# EAGLE design CoProcessorSP20 (EAGLE 9.6.2)

## Sheet 1 of 3: Connectors
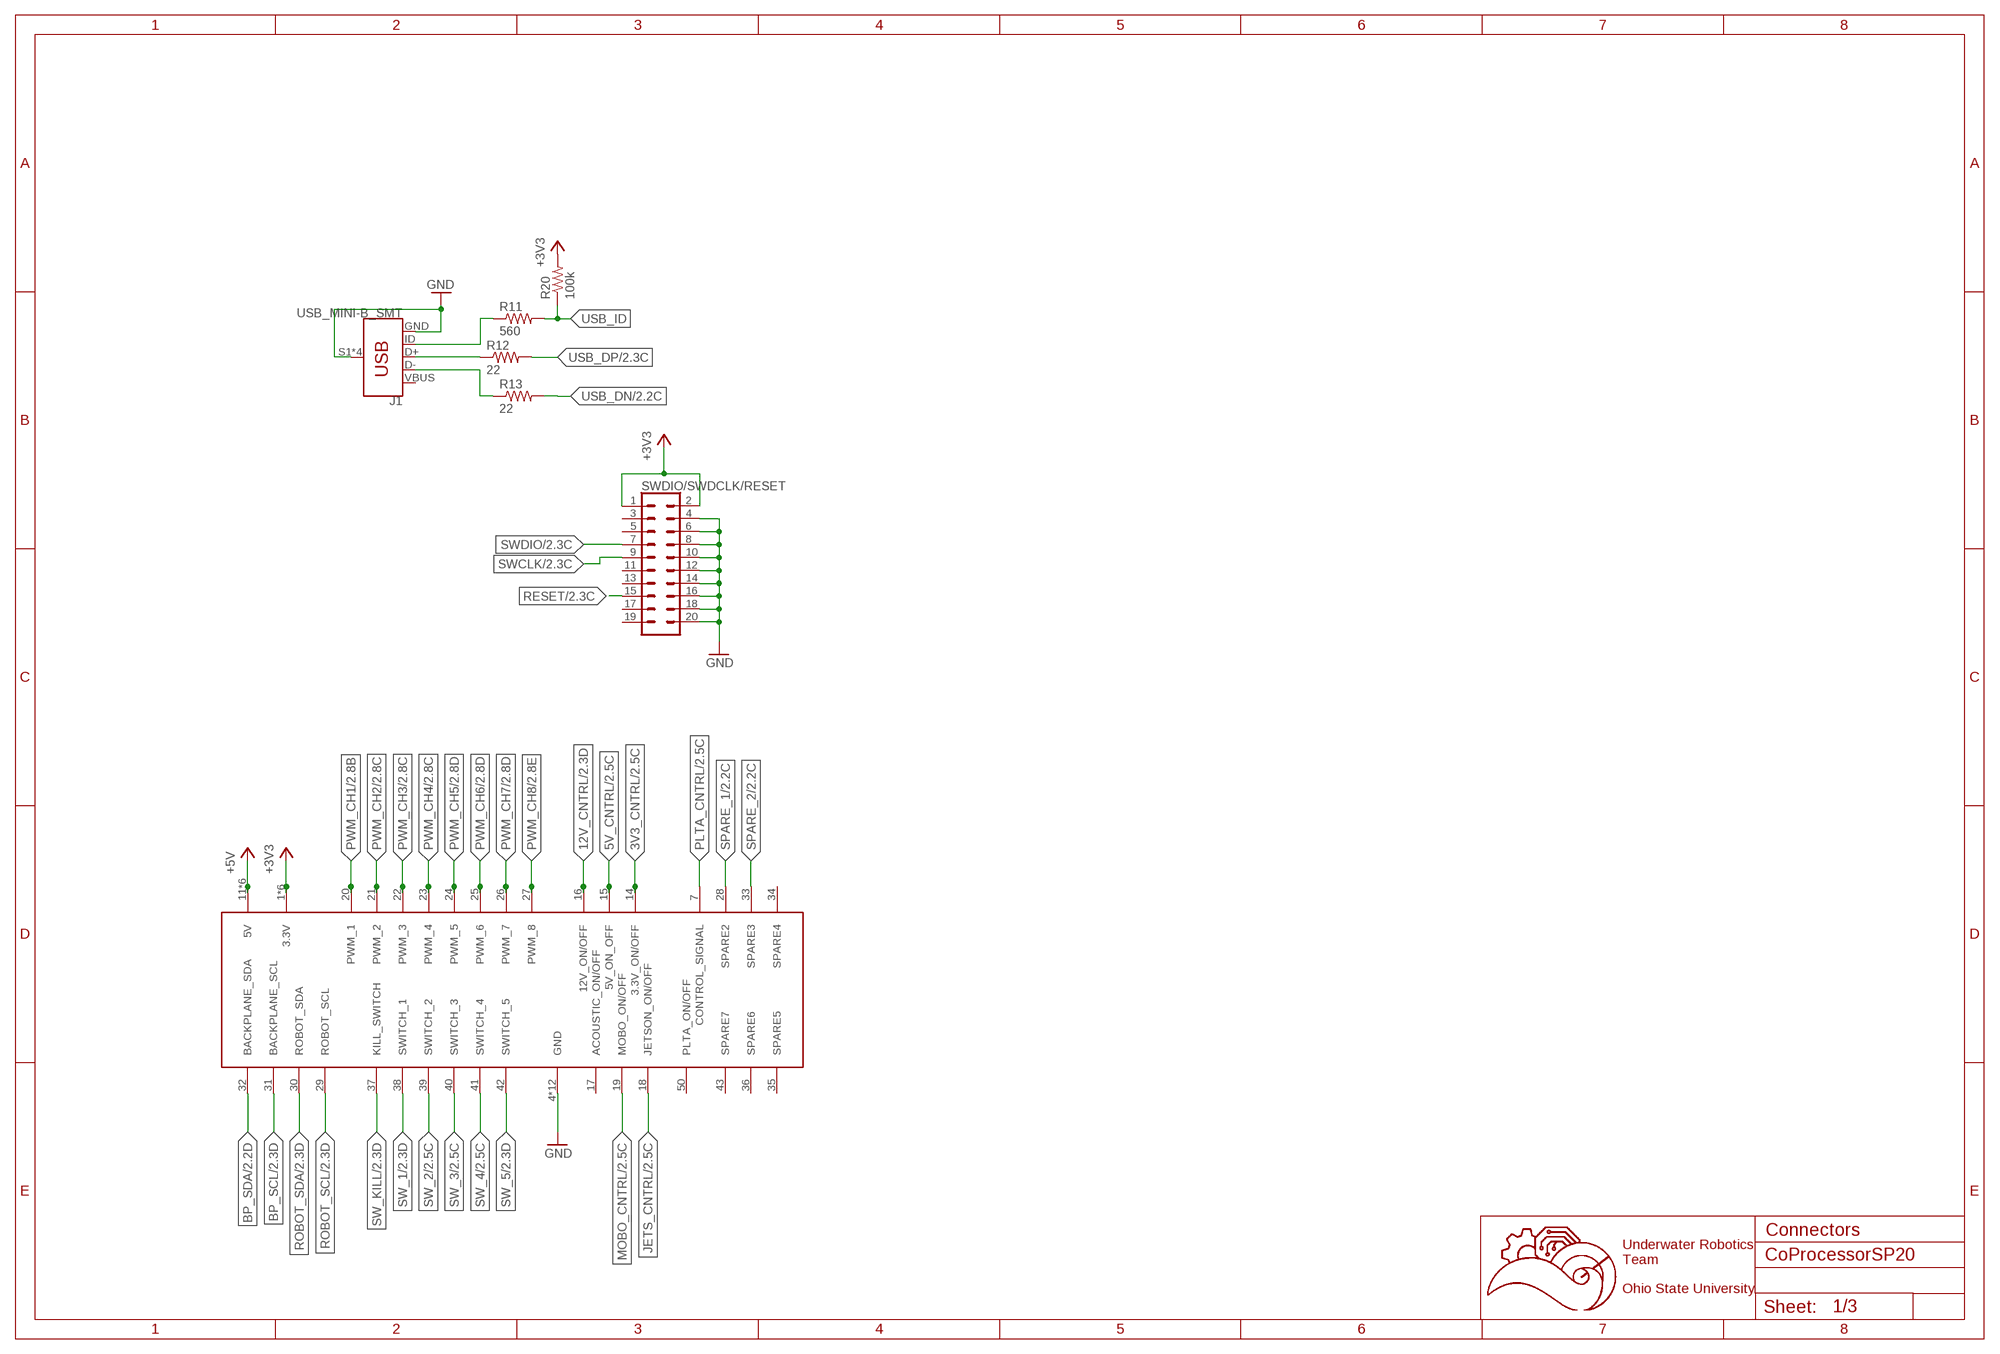
[diagram p0: schematic, sheet 1]

### Parts
J1  USB_MINI-B_SMT  [USB-MINIB]
R11  560  R-US_R0603  [R0603]
R12  22  R-US_R0603  [R0603]
R13  22  R-US_R0603  [R0603]
R20  100k  R-US_R0603  [R0603]
SWDIO/SWDCLK/RESET  CONN_10X2  [2X10]
U$1  5530843-EDGE  [5530843-6-BOARDFINGERS]

### Nets
3V3_CNTRL: U$1.14(3.3V_ON/OFF) ; also sheet 2
5V_CNTRL: U$1.15(5V_ON_OFF) ; also sheet 2
12V_CNTRL: U$1.16(12V_ON/OFF) ; also sheet 2
+3V3: R20.2 SWDIO/SWDCLK/RESET.1 SWDIO/SWDCLK/RESET.2 U$1.1(3.3V) U$1.2(3.3V) U$1.3(3.3V) U$1.54(3.3V) U$1.55(3.3V) U$1.56(3.3V) ; also sheet 2,3
+5V: U$1.11(5V) U$1.12(5V) U$1.13(5V) U$1.44(5V) U$1.45(5V) U$1.46(5V)
BP_SCL: U$1.31(BACKPLANE_SCL) ; also sheet 2
BP_SDA: U$1.32(BACKPLANE_SDA) ; also sheet 2
GND: J1.GND J1.S1(SHIELD) J1.S2(SHIELD) J1.S3(SHIELD) J1.S4(SHIELD) SWDIO/SWDCLK/RESET.4 SWDIO/SWDCLK/RESET.6 SWDIO/SWDCLK/RESET.8 SWDIO/SWDCLK/RESET.10 SWDIO/SWDCLK/RESET.12 SWDIO/SWDCLK/RESET.14 SWDIO/SWDCLK/RESET.16 SWDIO/SWDCLK/RESET.18 SWDIO/SWDCLK/RESET.20 U$1.4(GND) U$1.5(GND) U$1.6(GND) U$1.8(GND) U$1.9(GND) U$1.10(GND) U$1.47(GND) U$1.48(GND) U$1.49(GND) U$1.51(GND) U$1.52(GND) U$1.53(GND) ; also sheet 2,3
JETS_CNTRL: U$1.18(JETSON_ON/OFF) ; also sheet 2
MOBO_CNTRL: U$1.19(MOBO_ON/OFF) ; also sheet 2
N$2: J1.ID R11.1
N$4: J1.D+ R12.1
N$5: J1.D- R13.1
PLTA_CNTRL: U$1.7(CONTROL_SIGNAL) ; also sheet 2
PWM_CH1: U$1.20(PWM_1) ; also sheet 2
PWM_CH2: U$1.21(PWM_2) ; also sheet 2
PWM_CH3: U$1.22(PWM_3) ; also sheet 2
PWM_CH4: U$1.23(PWM_4) ; also sheet 2
PWM_CH5: U$1.24(PWM_5) ; also sheet 2
PWM_CH6: U$1.25(PWM_6) ; also sheet 2
PWM_CH7: U$1.26(PWM_7) ; also sheet 2
PWM_CH8: U$1.27(PWM_8) ; also sheet 2
RESET: SWDIO/SWDCLK/RESET.15 ; also sheet 2
ROBOT_SCL: U$1.29(ROBOT_SCL) ; also sheet 2
ROBOT_SDA: U$1.30(ROBOT_SDA) ; also sheet 2
SPARE_1: U$1.28(SPARE2) ; also sheet 2
SPARE_2: U$1.33(SPARE3) ; also sheet 2
SW_1: U$1.38(SWITCH_1) ; also sheet 2
SW_2: U$1.39(SWITCH_2) ; also sheet 2
SW_3: U$1.40(SWITCH_3) ; also sheet 2
SW_4: U$1.41(SWITCH_4) ; also sheet 2
SW_5: U$1.42(SWITCH_5) ; also sheet 2
SW_KILL: U$1.37(KILL_SWITCH) ; also sheet 2
SWCLK: SWDIO/SWDCLK/RESET.9 ; also sheet 2
SWDIO: SWDIO/SWDCLK/RESET.7 ; also sheet 2
USB_DN: R13.2 ; also sheet 2
USB_DP: R12.2 ; also sheet 2
USB_ID: R11.2 R20.1
Unconnected: SWDIO/SWDCLK/RESET.3 SWDIO/SWDCLK/RESET.5 SWDIO/SWDCLK/RESET.11 SWDIO/SWDCLK/RESET.13 SWDIO/SWDCLK/RESET.17 SWDIO/SWDCLK/RESET.19 U$1.17(ACOUSTIC_ON/OFF) U$1.34(SPARE4) U$1.35(SPARE5) U$1.36(SPARE6) U$1.43(SPARE7) U$1.50(PLTA_ON/OFF)

### Notes on the sheet
- Connectors
- Underwater Robotics
  Team
  
  Ohio State University

## Sheet 2 of 3: MCU
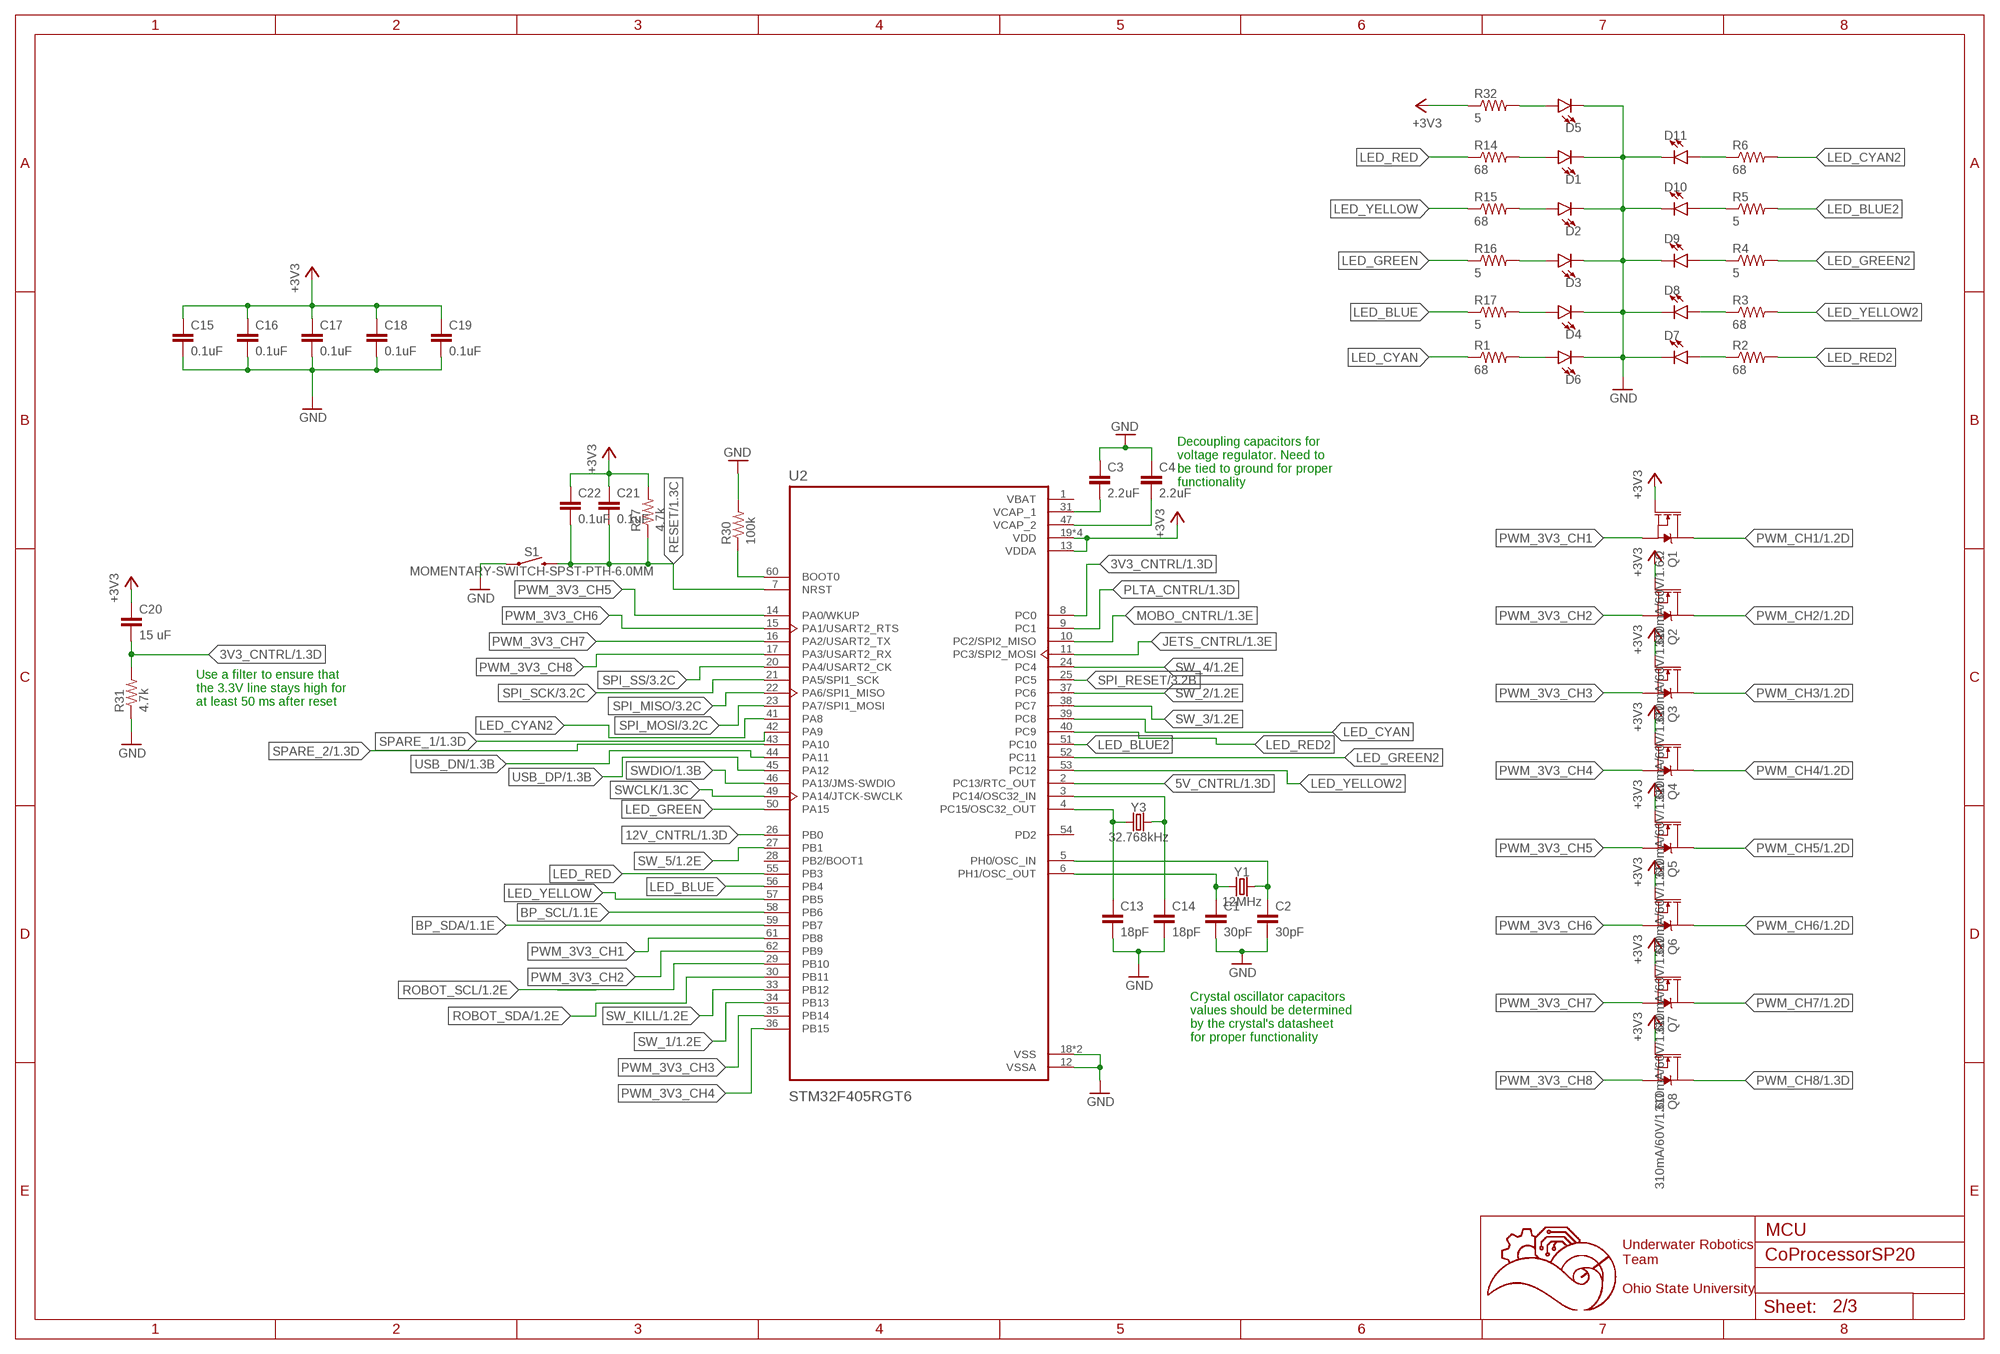
[diagram p1: schematic, sheet 2]

### Parts
C1  30pF  C-EUC0603  [C0603]
C2  30pF  C-EUC0603  [C0603]
C3  2.2uF  C-EUC0603  [C0603]
C4  2.2uF  C-EUC0603  [C0603]
C13  18pF  C-EUC0603  [C0603]
C14  18pF  C-EUC0603  [C0603]
C15  0.1uF  C-EUC0603  [C0603]
C16  0.1uF  C-EUC0603  [C0603]
C17  0.1uF  C-EUC0603  [C0603]
C18  0.1uF  C-EUC0603  [C0603]
C19  0.1uF  C-EUC0603  [C0603]
C20  15 uF  C-EU050-025X075  [C050-025X075]
C21  0.1uF  C-EUC0603  [C0603]
C22  0.1uF  C-EUC0603  [C0603]
D1  LED0603  [LED-0603]
D2  LED0603  [LED-0603]
D3  LED0603  [LED-0603]
D4  LED0603  [LED-0603]
D5  LED0603  [LED-0603]
D6  LED0603  [LED-0603]
D7  LED0603  [LED-0603]
D8  LED0603  [LED-0603]
D9  LED0603  [LED-0603]
D10  LED0603  [LED-0603]
D11  LED0603  [LED-0603]
Q1  310mA/60V/1.6Ω  MOSFET-NCH-2N7002PW  [SOT323]
Q2  310mA/60V/1.6Ω  MOSFET-NCH-2N7002PW  [SOT323]
Q3  310mA/60V/1.6Ω  MOSFET-NCH-2N7002PW  [SOT323]
Q4  310mA/60V/1.6Ω  MOSFET-NCH-2N7002PW  [SOT323]
Q5  310mA/60V/1.6Ω  MOSFET-NCH-2N7002PW  [SOT323]
Q6  310mA/60V/1.6Ω  MOSFET-NCH-2N7002PW  [SOT323]
Q7  310mA/60V/1.6Ω  MOSFET-NCH-2N7002PW  [SOT323]
Q8  310mA/60V/1.6Ω  MOSFET-NCH-2N7002PW  [SOT323]
R1  68  R-US_R0603  [R0603]
R2  68  R-US_R0603  [R0603]
R3  68  R-US_R0603  [R0603]
R4  5  R-US_R0603  [R0603]
R5  5  R-US_R0603  [R0603]
R6  68  R-US_R0603  [R0603]
R14  68  R-US_R0603  [R0603]
R15  68  R-US_R0603  [R0603]
R16  5  R-US_R0603  [R0603]
R17  5  R-US_R0603  [R0603]
R27  4.7k  R-US_R0603  [R0603]
R30  100k  R-US_R0603  [R0603]
R31  4.7k  R-US_R0603  [R0603]
R32  5  R-US_R0603  [R0603]
S1  MOMENTARY-SWITCH-SPST-PTH-6.0MM  [TACTILE_SWITCH_PTH_6.0MM]
U2  STM32F405RGT6  [QFP50P1200X1200X160-64N]
Y1  12MHz  CRYSTAL-16MHZPTH-HC49US  [HC49US]
Y3  32.768kHz  CRYSTAL-32.768KHZSMD-3.2X1.5  [CRYSTAL-SMD-3.2X1.5MM]

### Nets
3V3_CNTRL: C20.2 R31.2 U2.8(PC0) ; also sheet 1
5V_CNTRL: U2.2(PC13/RTC_OUT) ; also sheet 1
12V_CNTRL: U2.26(PB0) ; also sheet 1
+3V3: C15.1 C16.1 C17.1 C18.1 C19.1 C20.1 C21.1 C22.1 Q1.1(G) Q2.1(G) Q3.1(G) Q4.1(G) Q5.1(G) Q6.1(G) Q7.1(G) Q8.1(G) R27.2 R32.1 U2.13(VDDA) U2.19(VDD) U2.32(VDD) U2.48(VDD) U2.64(VDD) ; also sheet 1,3
BP_SCL: U2.58(PB6) ; also sheet 1
BP_SDA: U2.59(PB7) ; also sheet 1
GND: C1.2 C2.2 C3.1 C4.1 C13.2 C14.2 C15.2 C16.2 C17.2 C18.2 C19.2 D1.C D2.C D3.C D4.C D5.C D6.C D7.C D8.C D9.C D10.C D11.C R30.2 R31.1 S1.1 U2.12(VSSA) U2.18(VSS) U2.63(VSS) ; also sheet 1,3
JETS_CNTRL: U2.11(PC3/SPI2_MOSI) ; also sheet 1
LED_BLUE: R17.1 U2.56(PB4)
LED_BLUE2: R5.2 U2.51(PC10)
LED_CYAN: R1.1 U2.39(PC8)
LED_CYAN2: R6.2 U2.41(PA8)
LED_GREEN: R16.1 U2.50(PA15)
LED_GREEN2: R4.2 U2.52(PC11)
LED_RED: R14.1 U2.55(PB3)
LED_RED2: R2.2 U2.40(PC9)
LED_YELLOW: R15.1 U2.57(PB5)
LED_YELLOW2: R3.2 U2.53(PC12)
MOBO_CNTRL: U2.10(PC2/SPI2_MISO) ; also sheet 1
N$1: C1.1 U2.6(PH1/OSC_OUT) Y1.1
N$3: D1.A R14.2
N$6: D2.A R15.2
N$7: D3.A R16.2
N$8: D4.A R17.2
N$9: C2.1 U2.5(PH0/OSC_IN) Y1.2
N$10: C4.2 U2.47(VCAP_2)
N$11: C3.2 U2.31(VCAP_1)
N$15: C13.1 U2.4(PC15/OSC32_OUT) Y3.P$1
N$29: C14.1 U2.3(PC14/OSC32_IN) Y3.P$2
N$30: R30.1 U2.60(BOOT0)
N$31: D5.A R32.2
N$32: D6.A R1.2
N$33: D7.A R2.1
N$35: D8.A R3.1
N$36: D9.A R4.1
N$37: D10.A R5.1
N$38: D11.A R6.1
PLTA_CNTRL: U2.9(PC1) ; also sheet 1
PWM_3V3_CH1: Q1.2(S) U2.61(PB8)
PWM_3V3_CH2: Q2.2(S) U2.62(PB9)
PWM_3V3_CH3: Q3.2(S) U2.35(PB14)
PWM_3V3_CH4: Q4.2(S) U2.36(PB15)
PWM_3V3_CH5: Q5.2(S) U2.14(PA0/WKUP)
PWM_3V3_CH6: Q6.2(S) U2.15(PA1/USART2_RTS)
PWM_3V3_CH7: Q7.2(S) U2.16(PA2/USART2_TX)
PWM_3V3_CH8: Q8.2(S) U2.17(PA3/USART2_RX)
PWM_CH1: Q1.3(D) ; also sheet 1
PWM_CH2: Q2.3(D) ; also sheet 1
PWM_CH3: Q3.3(D) ; also sheet 1
PWM_CH4: Q4.3(D) ; also sheet 1
PWM_CH5: Q5.3(D) ; also sheet 1
PWM_CH6: Q6.3(D) ; also sheet 1
PWM_CH7: Q7.3(D) ; also sheet 1
PWM_CH8: Q8.3(D) ; also sheet 1
RESET: C21.2 C22.2 R27.1 S1.3 U2.7(NRST) ; also sheet 1
ROBOT_SCL: U2.29(PB10) ; also sheet 1
ROBOT_SDA: U2.30(PB11) ; also sheet 1
SPARE_1: U2.42(PA9) ; also sheet 1
SPARE_2: U2.43(PA10) ; also sheet 1
SPI_MISO: U2.22(PA6/SPI1_MISO) ; also sheet 3
SPI_MOSI: U2.23(PA7/SPI1_MOSI) ; also sheet 3
SPI_RESET: U2.25(PC5) ; also sheet 3
SPI_SCK: U2.21(PA5/SPI1_SCK) ; also sheet 3
SPI_SS: U2.20(PA4/USART2_CK) ; also sheet 3
SW_1: U2.34(PB13) ; also sheet 1
SW_2: U2.37(PC6) ; also sheet 1
SW_3: U2.38(PC7) ; also sheet 1
SW_4: U2.24(PC4) ; also sheet 1
SW_5: U2.27(PB1) ; also sheet 1
SW_KILL: U2.33(PB12) ; also sheet 1
SWCLK: U2.49(PA14/JTCK-SWCLK) ; also sheet 1
SWDIO: U2.46(PA13/JMS-SWDIO) ; also sheet 1
USB_DN: U2.44(PA11) ; also sheet 1
USB_DP: U2.45(PA12) ; also sheet 1
Unconnected: U2.28(PB2/BOOT1) U2.54(PD2)

### Notes on the sheet
- Decoupling capacitors for 
  voltage regulator. Need to
  be tied to ground for proper
  functionality
- Use a filter to ensure that
  the 3.3V line stays high for
  at least 50 ms after reset
- Crystal oscillator capacitors
  values should be determined
  by the crystal's datasheet
  for proper functionality
- MCU
- Underwater Robotics
  Team
  
  Ohio State University

## Sheet 3 of 3: Ethernet
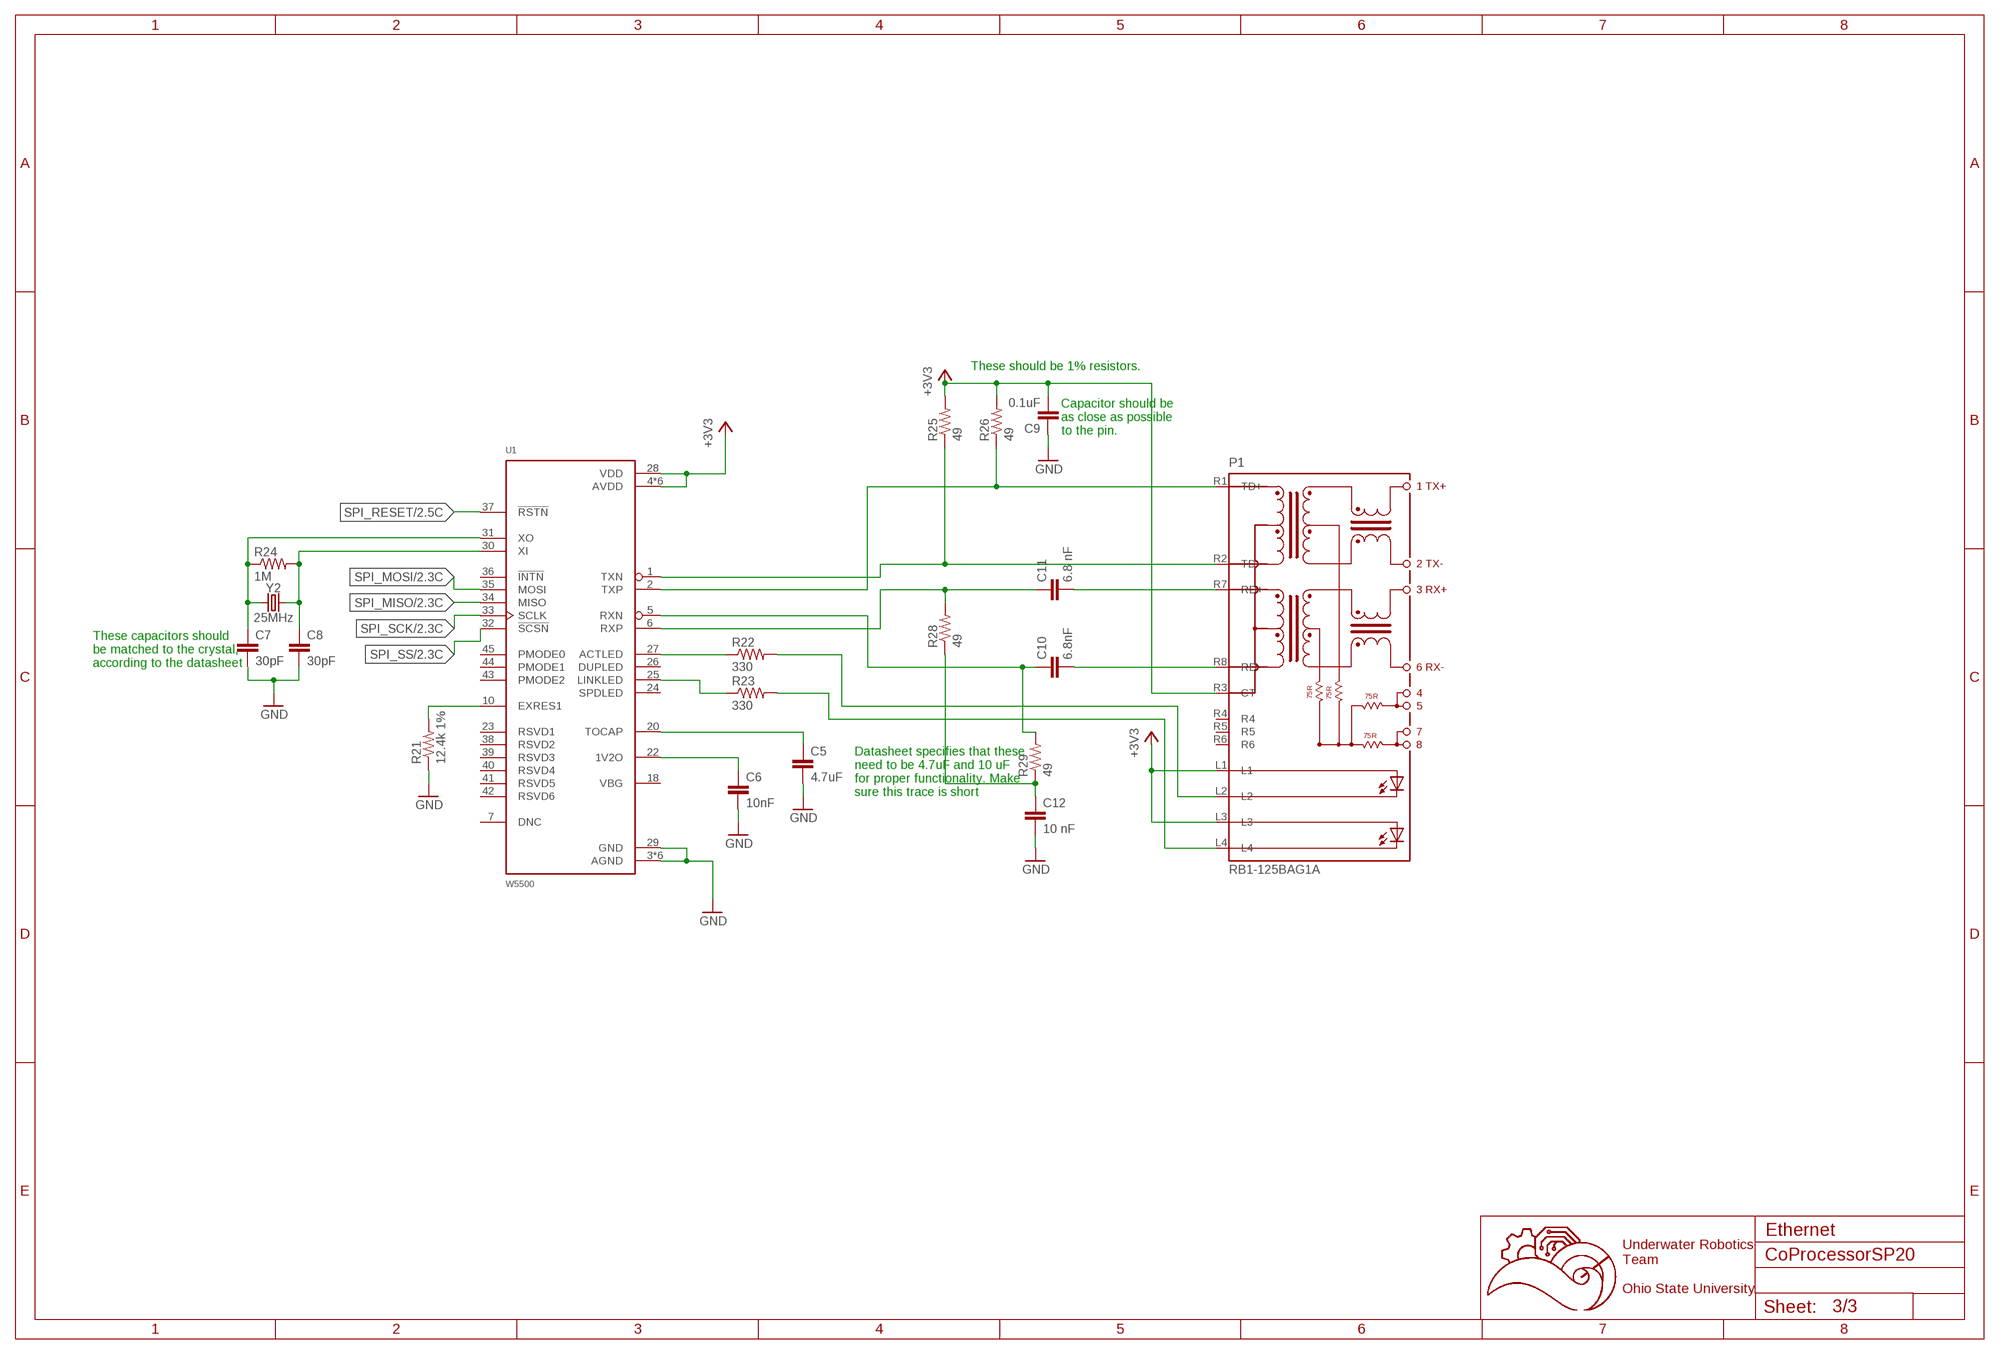
[diagram p2: schematic, sheet 3]

### Parts
C5  4.7uF  C-EUC0603  [C0603]
C6  10nF  C-EUC0603  [C0603]
C7  30pF  C-EUC0603  [C0603]
C8  30pF  C-EUC0603  [C0603]
C9  0.1uF  C-EUC0603  [C0603]
C10  6.8nF  C-EUC0603  [C0603]
C11  6.8 nF  C-EUC0603  [C0603]
C12  10 nF  C-EUC0603  [C0603]
P1  RB1-125BAG1A  [WIZNET_RB1-125BAG1A]
R21  12.4k 1%  R-US_R0603  [R0603]
R22  330  R-US_R0603  [R0603]
R23  330  R-US_R0603  [R0603]
R24  1M  R-US_R0603  [R0603]
R25  49  R-US_R0603  [R0603]
R26  49  R-US_R0603  [R0603]
R28  49  R-US_R0603  [R0603]
R29  49  R-US_R0603  [R0603]
U1  W5500  [QFP50P900X900X160-48N]
Y2  25MHz  CRYSTALPTH-HC49US  [HC49US]

### Nets
+3V3: C9.2 P1.L1 P1.L3 P1.R3(CT) R25.2 R26.2 U1.4(AVDD) U1.8(AVDD) U1.11(AVDD) U1.15(AVDD) U1.17(AVDD) U1.21(AVDD) U1.28(VDD) ; also sheet 1,2
GND: C5.2 C6.2 C7.2 C8.2 C9.1 C12.2 R21.1 U1.3(AGND) U1.9(AGND) U1.14(AGND) U1.16(AGND) U1.19(AGND) U1.29(GND) U1.48(AGND) ; also sheet 1,2
N$12: C5.1 U1.20(TOCAP)
N$13: C6.1 U1.22(1V2O)
N$14: R21.2 U1.10(EXRES1)
N$16: P1.R2(TD-) R25.1 U1.1(TXN)
N$17: P1.R1(TD+) R26.1 U1.2(TXP)
N$18: C10.1 R29.2 U1.5(RXN)
N$19: C11.1 R28.2 U1.6(RXP)
N$20: P1.L2 R22.2
N$21: P1.L4 R23.2
N$22: R22.1 U1.27(ACTLED)
N$23: R23.1 U1.25(LINKLED)
N$24: C8.1 R24.2 U1.30(XI) Y2.2
N$25: C7.1 R24.1 U1.31(XO) Y2.1
N$26: C10.2 P1.R8(RD-)
N$27: C11.2 P1.R7(RD+)
N$28: C12.1 R28.1 R29.1
SPI_MISO: U1.34(MISO) ; also sheet 2
SPI_MOSI: U1.35(MOSI) ; also sheet 2
SPI_RESET: U1.37(!RSTN) ; also sheet 2
SPI_SCK: U1.33(SCLK) ; also sheet 2
SPI_SS: U1.32(!SCSN) ; also sheet 2
Unconnected: P1.R4 P1.R5 P1.R6 U1.7(DNC) U1.18(VBG) U1.23(RSVD1) U1.24(SPDLED) U1.26(DUPLED) U1.36(!INTN) U1.38(RSVD2) U1.39(RSVD3) U1.40(RSVD4) U1.41(RSVD5) U1.42(RSVD6) U1.43(PMODE2) U1.44(PMODE1) U1.45(PMODE0)

### Notes on the sheet
- These should be 1% resistors.
- Capacitor should be
  as close as possible
  to the pin.
- These capacitors should
  be matched to the crystal,
  according to the datasheet
- Datasheet specifies that these
  need to be 4.7uF and 10 uF
  for proper functionality. Make 
  sure this trace is short
- Ethernet
- Underwater Robotics
  Team
  
  Ohio State University

## Power pins joined to a net without a drawn wire
VBAT: U2.1(VBAT)
VBUS: J1.VBUS

## Library data of the parts
C1-C22 = rcl:C-EU: CAPACITOR, European symbol; SPICEPREFIX: C
D1-D11 = SparkFun-LED:LED: LED (Generic) Standard schematic elements and footprints for 5mm, 3mm, 1206, and 0603 sized LEDs. Generic LEDs with no color specified.
J1 = SparkFun-Connectors:USB_MINI-B: USB type Mini-B Connector Breaks out 5th pin, and includes shield pins if needed. SparkFun Products: SparkFun FTDI Basic Breakout <https://www.sparkfun.com/products/9716> SparkFun XBee Explorer USB <https://www.sparkfun.com/products/11812> SparkFun Redboard <https://www.sparkfun.com/products/12757>; PROD_ID: CONN-08193; SF_ID: PRT-00587
P1 = RJ45-MAGJACK:RB1-125BAG1A: Accessory RJ-45 With Transformer Connector - UDE; AVAILABILITY: Unavailable; DESCRIPTION: Accessory RJ-45 With Transformer Connector - UDE; MF: WIZnet; MP: RB1-125BAG1A; PACKAGE: HVQFN-36 NXP Semiconductors; PRICE: None
Q1-Q8 = SparkFun-DiscreteSemi:MOSFET-NCH: N-channel MOSFETs Voltage controlled devices that allow control of high current outputs. SparkFun Products: SparkFun OpenScale <https://www.sparkfun.com/products/13261> SparkFun Digital Sandbox <https://www.sparkfun.com/products/12651> SparkFun Monster Moto Shield <https://www.sparkfun.com/products/10182> SparkFun MOSFET Power Controller <https://www.sparkfun.com/products/11214>; PROD_ID: TRANS-11151
R1-R6 R11-R17 R20-R32 = rcl:R-US_: RESISTOR, American symbol; SPICEPREFIX: R
S1 = SparkFun-Switches:MOMENTARY-SWITCH-SPST: Momentary Switch (Pushbutton) - SPST Normally-open (NO) SPST momentary switches (buttons, pushbuttons). Variants PTH-12MM - 12mm square, through-hole Momentary Pushbutton Switch - 12mm Square <https://www.sparkfun.com/products/9190> (COM-09190) PTH-6.0MM, PTH-6.0MM-KIT - 6.0mm square, through-hole Mini Pushbutton Switch <https://www.sparkfun.com/products/97> (COM-00097) KIT package intended for soldering kit's - only one side of pads' copper is exposed. PTH-RIGHT-ANGLE-KIT - Right-angle, through-hole Right Angle Tactile Button <https://www.sparkfun.com/products/10791> - Used on SparkFun BigTime Watch Kit <https://www.sparkfun.com/products/11734> SMD-12MM - 12mm square, surface-mount Tactile Button - SMD (12mm) <https://www.sparkfun.com/products/12993> (COM-12993) Used on SparkFun PicoBoard <https://www.sparkfun.com/products/11888> SMD-4.5MM - 4.5mm Square Trackball Switch Used on SparkFun Blackberry Trackballer Breakout <https://www.sparkfun.com/products/13169> SMD-4.6MMX2.8MM - 4.60mm x 2.80mm, surface mount Used on SparkFun SAMD21 Mini Breakout <https://www.sparkfun.com/products/13664> SMD-5.2MM, SMD-5.2-REDUNDANT - 5.2mm square, surface-mount Mini Pushbutton Switch - SMD <https://www.sparkfun.com/products/8720> (COM-08720) Used on Arduino Pro Mini <https://www.sparkfun.com/products/11114> REDUNDANT package connects both switch circuits together SMD-6.0X3.5MM - 6.0 x 3.5mm, surface mount Momentary Reset Switch SMD <https://www.sparkfun.com/products/8229> (COM-08229) SMD-6.2MM-TALL - 6.2mm square, surface mount Tactile Button - SMD (6mm) <https://www.sparkfun.com/products/12992> Used on SparkFun Digital Sandbox <https://www.sparkfun.com/products/12651> SMD-RIGHT-ANGLE - Right-angle, surface mount Used on SparkFun Block for Intel® Edison - Arduino <https://www.sparkfun.com/products/13036>; PROD_ID: SWCH-08441; SF_SKU: COM-00097
SWDIO/SWDCLK/RESET = SparkFun-Connectors:CONN_10X2: Multi connection point. Often used as Generic Header-pin footprint for 0.1 inch spaced/style header connections On any of the 0.1 inch spaced packages, you can populate with these: Break Away Headers - Straight <https://www.sparkfun.com/products/116> (PRT-00116) Break Away Male Headers - Right Angle <https://www.sparkfun.com/products/553> (PRT-00553) Female Headers <https://www.sparkfun.com/products/115> (PRT-00115) Break Away Headers - Machine Pin <https://www.sparkfun.com/products/117> (PRT-00117) Break Away Female Headers - Swiss Machine Pin <https://www.sparkfun.com/products/743> (PRT-00743) Special note about the "SPECIAL" package: This was SPECIALLY designed to be used with our Graphic LCD Backpack. Be sure you want to use this! It is not only staggered on each line of header holes, but IT IS ALSO offset of the center point of the top and bottom lines by 5 mil. This causes the headers to lock into place on the "standard" footprint on the LCD screen. The extra squares on the tdocu layer are there simply to reference other pins (if you were to actually populate a longer header than ten long - this is what we do with the backpacks).
U1 = W5500:W5500: Hardwired TCP/IP embedded Ethernet controller; AVAILABILITY: Unavailable; DESCRIPTION: Victor Pure White Collection Wood Tidy Tower Organizer; MF: WIZnet; MP: W5500; PACKAGE: LQFP-48 Victor Technologies; PRICE: None
U2 = STM32F405RGT6:STM32F405RGT6: High-performance foundation line, ARM Cortex-M4 core with DSP and FPU, 1 Mbyte Flash, 168 MHz CPU, ART Accelerator; AVAILABILITY: Unavailable; DESCRIPTION: High-performance foundation line, ARM Cortex-M4 core with DSP and FPU, 1 Mbyte Flash, 168 MHz CPU, ART Accelerator; MF: STMicroelectronics; MP: STM32F405RGT6; PACKAGE: LQFP-64 STMicroelectronics; PRICE: None
U$1 = 5530843-6:5530843-EDGE
Y1 = SparkFun-Clocks:CRYSTAL-16MHZ: 16MHz Crystal Digikey Example <http://www.digikey.com/product-search/en?keywords=535-9122-1-ND> Frequency: 16MHz Frequency Stability: ±50ppm Frequency Tolerance: ±20ppm Load Capacitance: 18pF SparkFun Products: Pro Micro -5V/16MHz <https://www.sparkfun.com/products/12640> SparkFun Serial Enabled LCD Kit <https://www.sparkfun.com/products/10097>; PROD_ID: XTAL-08181; SF_ID: COM-00536; VALUE: 16MHz
Y2 = SparkFun-Clocks:CRYSTAL: Crystals (Generic) These are passive quartz crystals, which can be used as a clock source for a microcontroller. Crystal's are two-terminal devices. They require external "load" capacitors to generate an oscillating signal.
Y3 = SparkFun-Clocks:CRYSTAL-32.768KHZ: 32.768kHz Crystal Frequency: 32.768kHz Frequency Stability: ±20ppm Load Capacitance: 12.5pF (PTH-2X6 & SMD-3.2X1.5), 6pF (SMD-2X6) SparkFun Products: SparkFun BigTime Watch Kit <https://www.sparkfun.com/products/11734> SparkFun nRF52832 Breakout <https://www.sparkfun.com/products/13990> SparkFun Real Time Clock Module <https://www.sparkfun.com/products/12708>; PROD_ID: XTAL-13062

## Board
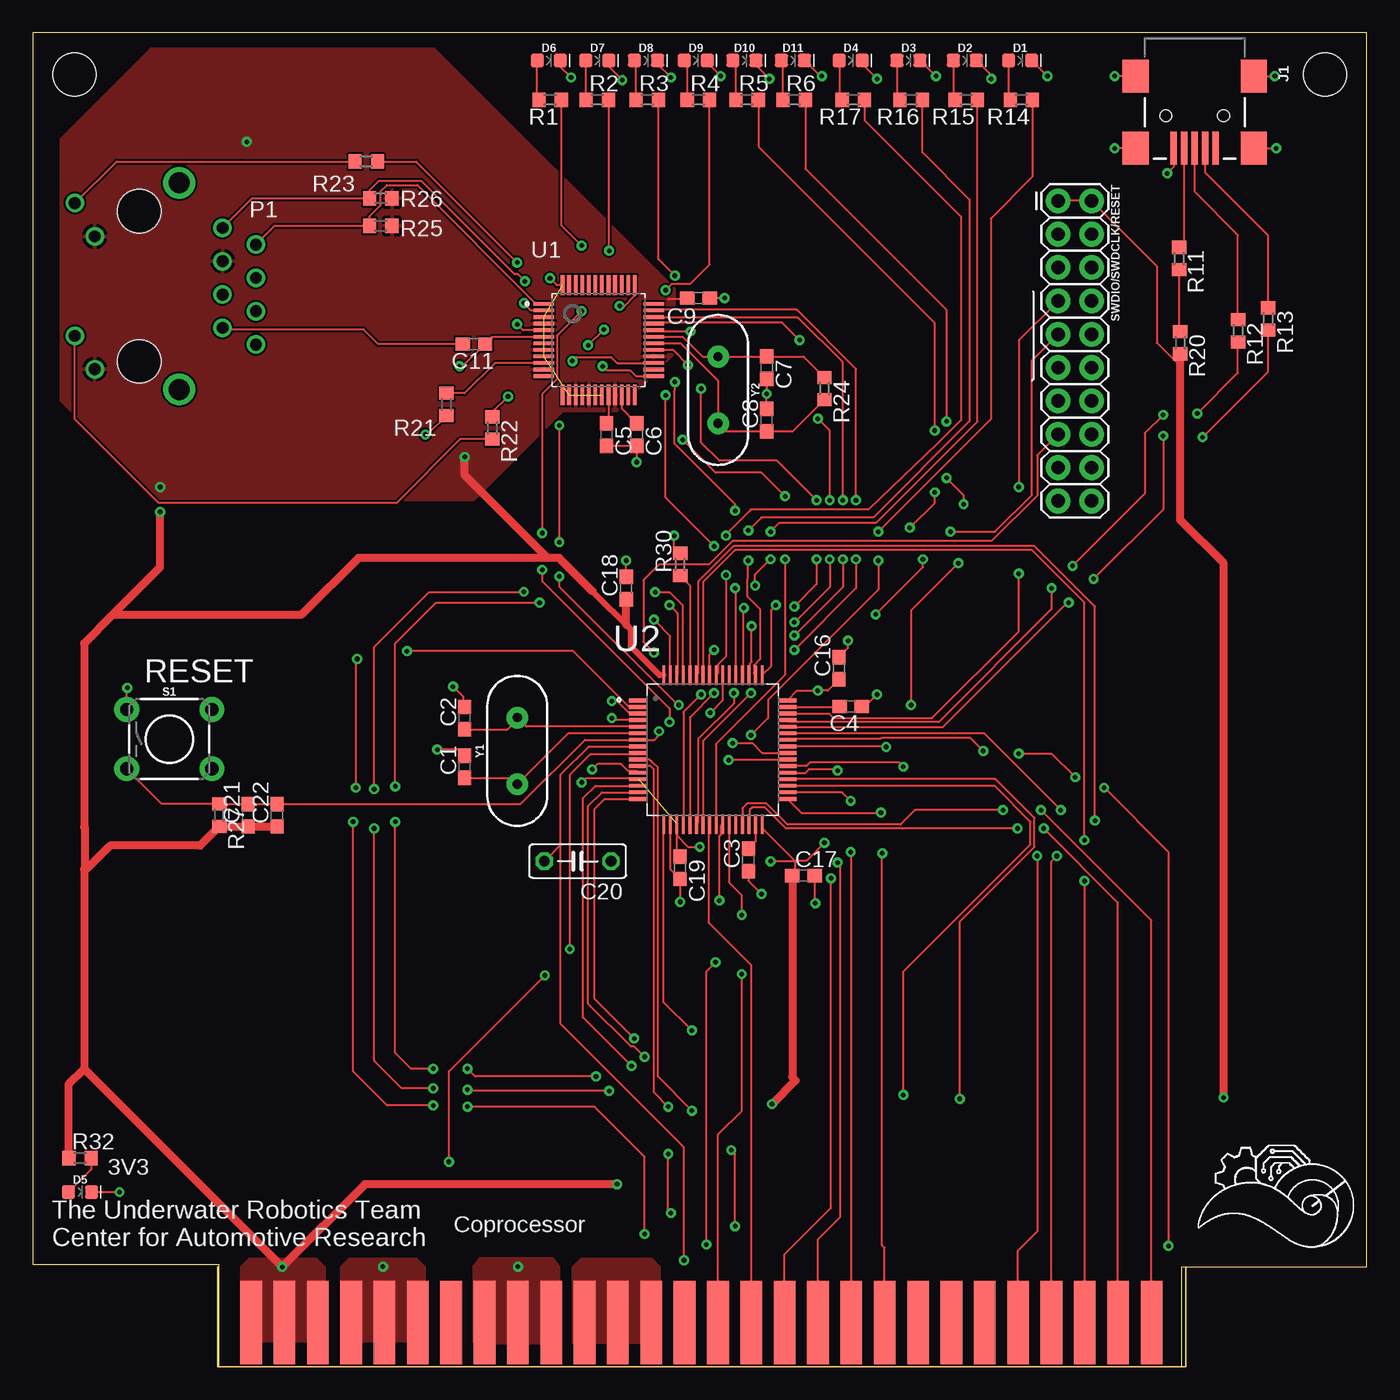
[diagram p3: board, top side]
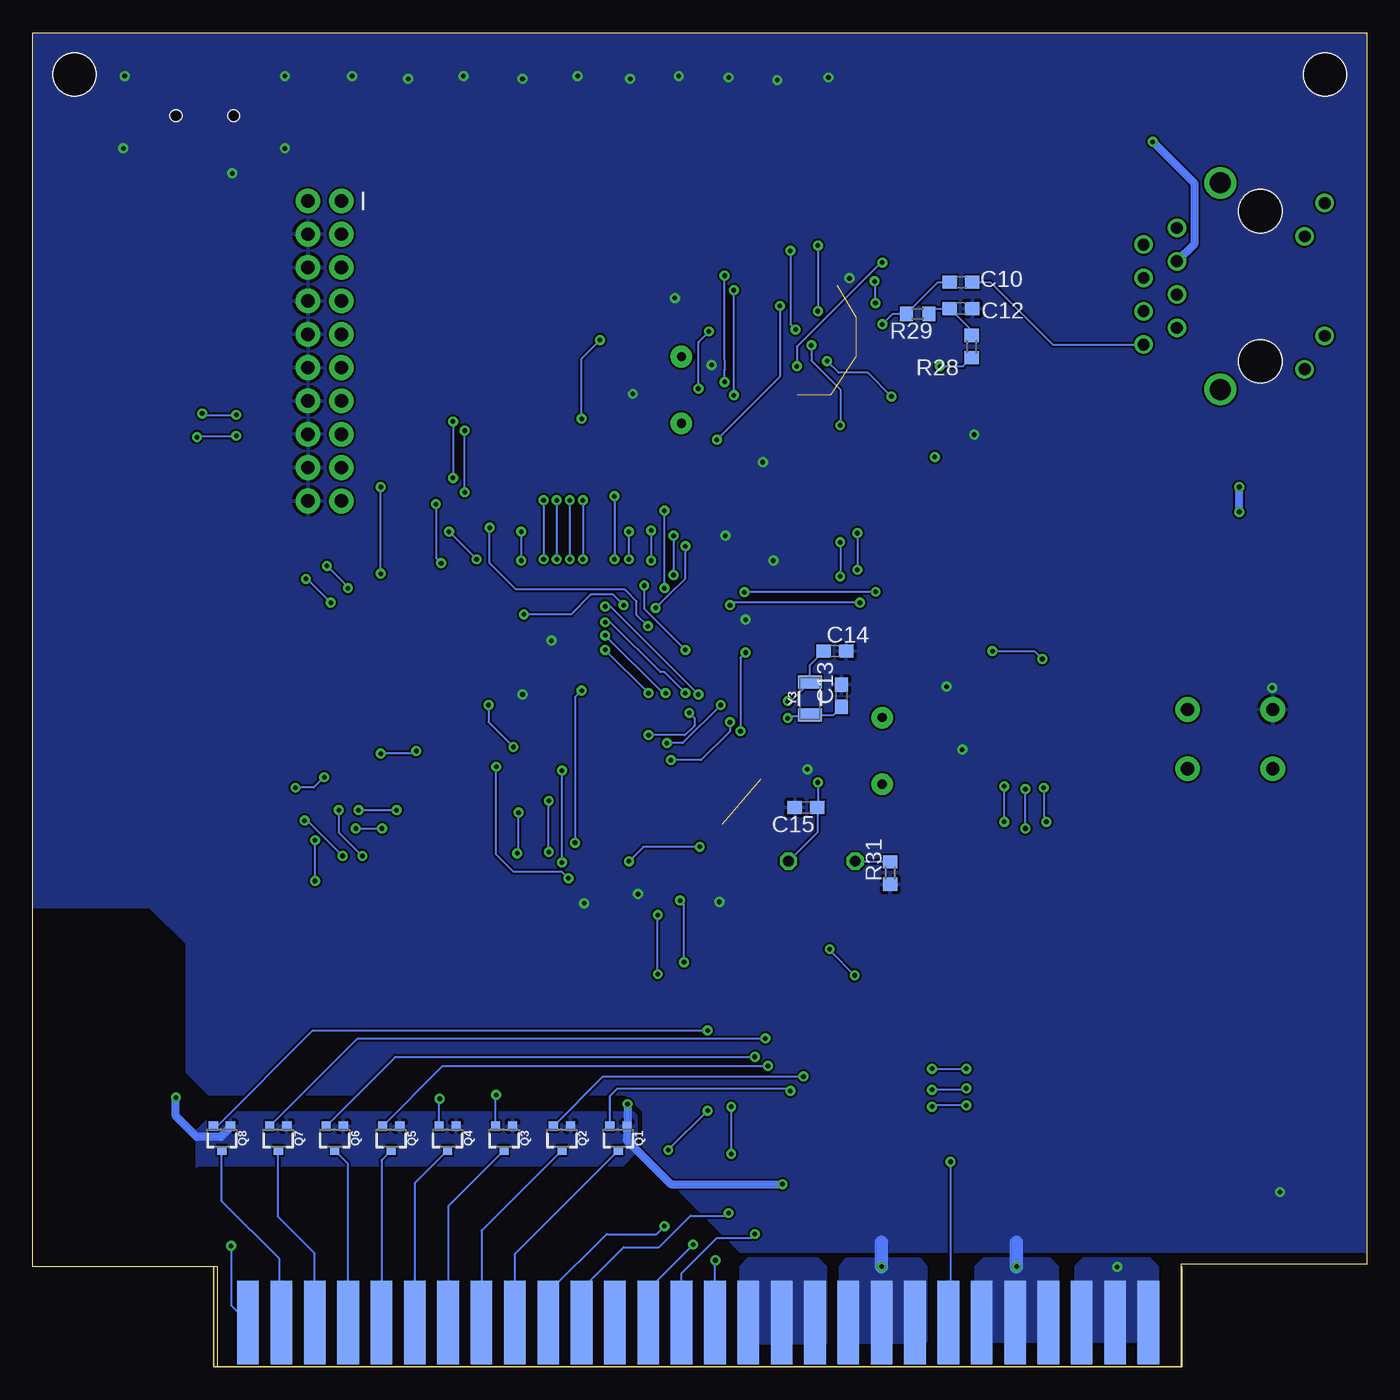
[diagram p4: board, bottom side, seen from below]

Size 101.6 x 101.6 mm. Coordinates in mm from the lower left corner, seen from the top.
Outline: 0,7.8 14.14,7.8 14.14,0 87.53,0 87.53,7.62 101.6,7.62 101.6,101.6 0,101.6 0,7.8
Copper layers (1*16): Top 0.035mm / dielectric 1.5mm / Bottom 0.035mm
Design rules "default *": minimum track width 6mil, minimum drill 0.35mm, track to track 6mil, track to pad 6mil, pad to pad 6mil, via to via 6mil, smd to smd 6mil, copper to edge 0.00508125mm, drill to drill 6mil, minimum pad ring 10mil, minimum via ring 8mil, stop-mask expansion 4mil, vias tented up to drill 0mil, thermal gap 10mil
Holes 3.26 mm at 3.17,98.42 98.42,98.42

### Footprints (pad centres in the part's own frame; a part is rotated, then mirrored left to right if it is on the bottom)
C0603 = smd 1.1 x 1: 1 -0.85,0; 2 0.85,0
C050-025X075 = drill 0.813 octagon: 1 -2.54,0; 2 2.54,0
LED-0603 = smd 1 x 1: A -0.877,0; C 0.877,0
USB-MINIB = smd 2.5 x 0.5: D+ 2.5,0; D- 2.5,0.8; GND 2.5,-1.6; ID 2.5,-0.8; VBUS 2.5,1.6 | smd 2.5 x 2: S1 -3,4.5; S2 2.5,4.5; S3 -3,-4.5; S4 2.5,-4.5 | hole 0.9: 0,2.2; 0,-2.2
WIZNET_RB1-125BAG1A = drill 0.9: L1 6.325,-3.38; L2 3.784,-4.899; L3 -3.786,-3.379; L4 -6.325,-4.9 | drill 0.9 pad 1.3: R1 -4.446,6.349; R2 -3.176,8.889; R3 -1.906,6.349; R4 -0.636,8.889; R5 0.634,6.349; R6 1.904,8.889; R7 3.174,6.349; R8 4.444,8.889 | drill 1.6 pad 2.184: S1 -7.876,3.049; S2 7.874,3.049 | hole 3.3: 5.714,-0.001; -5.716,-0.001
SOT323 = smd 0.7 x 0.7: 1 -0.65,-0.925; 2 0.65,-0.925; 3 0,0.925
R0603 = smd 1 x 1.1: 1 -0.85,0; 2 0.85,0
TACTILE_SWITCH_PTH_6.0MM = drill 1.016 pad 1.88: 1 -3.251,2.261; 2 3.251,2.261; 3 -3.251,-2.261; 4 3.251,-2.261
2X10 = drill 1.016 pad 1.88: 1 0,0; 2 0,2.54; 3 2.54,0; 4 2.54,2.54; 5 5.08,0; 6 5.08,2.54; 7 7.62,0; 8 7.62,2.54; 9 10.16,0; 10 10.16,2.54; 11 12.7,0; 12 12.7,2.54; 13 15.24,0; 14 15.24,2.54; 15 17.78,0; 16 17.78,2.54; 17 20.32,0; 18 20.32,2.54; 19 22.86,0; 20 22.86,2.54
QFP50P900X900X160-48N = smd 1.56 x 0.28: 1 -4.18,2.75; 2 -4.18,2.25; 3 -4.18,1.75; 4 -4.18,1.25; 5 -4.18,0.75; 6 -4.18,0.25; 7 -4.18,-0.25; 8 -4.18,-0.75; 9 -4.18,-1.25; 10 -4.18,-1.75; 11 -4.18,-2.25; 12 -4.18,-2.75; 25 4.18,-2.75; 26 4.18,-2.25; 27 4.18,-1.75; 28 4.18,-1.25; 29 4.18,-0.75; 30 4.18,-0.25; 31 4.18,0.25; 32 4.18,0.75; 33 4.18,1.25; 34 4.18,1.75; 35 4.18,2.25; 36 4.18,2.75 | smd 0.28 x 1.56: 13 -2.75,-4.18; 14 -2.25,-4.18; 15 -1.75,-4.18; 16 -1.25,-4.18; 17 -0.75,-4.18; 18 -0.25,-4.18; 19 0.25,-4.18; 20 0.75,-4.18; 21 1.25,-4.18; 22 1.75,-4.18; 23 2.25,-4.18; 24 2.75,-4.18; 37 2.75,4.18; 38 2.25,4.18; 39 1.75,4.18; 40 1.25,4.18; 41 0.75,4.18; 42 0.25,4.18; 43 -0.25,4.18; 44 -0.75,4.18; 45 -1.25,4.18; 46 -1.75,4.18; 47 -2.25,4.18; 48 -2.75,4.18
QFP50P1200X1200X160-64N = smd 1.47 x 0.28: 1 -5.67,3.75; 2 -5.67,3.25; 3 -5.67,2.75; 4 -5.67,2.25; 5 -5.67,1.75; 6 -5.67,1.25; 7 -5.67,0.75; 8 -5.67,0.25; 9 -5.67,-0.25; 10 -5.67,-0.75; 11 -5.67,-1.25; 12 -5.67,-1.75; 13 -5.67,-2.25; 14 -5.67,-2.75; 15 -5.67,-3.25; 16 -5.67,-3.75; 33 5.67,-3.75; 34 5.67,-3.25; 35 5.67,-2.75; 36 5.67,-2.25; 37 5.67,-1.75; 38 5.67,-1.25; 39 5.67,-0.75; 40 5.67,-0.25; 41 5.67,0.25; 42 5.67,0.75; 43 5.67,1.25; 44 5.67,1.75; 45 5.67,2.25; 46 5.67,2.75; 47 5.67,3.25; 48 5.67,3.75 | smd 0.28 x 1.47: 17 -3.75,-5.67; 18 -3.25,-5.67; 19 -2.75,-5.67; 20 -2.25,-5.67; 21 -1.75,-5.67; 22 -1.25,-5.67; 23 -0.75,-5.67; 24 -0.25,-5.67; 25 0.25,-5.67; 26 0.75,-5.67; 27 1.25,-5.67; 28 1.75,-5.67; 29 2.25,-5.67; 30 2.75,-5.67; 31 3.25,-5.67; 32 3.75,-5.67; 49 3.75,5.67; 50 3.25,5.67; 51 2.75,5.67; 52 2.25,5.67; 53 1.75,5.67; 54 1.25,5.67; 55 0.75,5.67; 56 0.25,5.67; 57 -0.25,5.67; 58 -0.75,5.67; 59 -1.25,5.67; 60 -1.75,5.67; 61 -2.25,5.67; 62 -2.75,5.67; 63 -3.25,5.67; 64 -3.75,5.67
5530843-6-BOARDFINGERS = smd 1.651 x 6.35 bottom: 1 0.826,3.375; 2 3.365,3.375; 3 5.905,3.375; 4 8.445,3.375; 5 10.986,3.375; 6 13.525,3.375; 7 16.066,3.375; 8 18.605,3.375; 9 21.145,3.375; 10 23.686,3.375; 11 26.226,3.375; 12 28.765,3.375; 13 31.305,3.375; 14 33.846,3.375; 15 36.386,3.375; 16 38.925,3.375; 17 41.465,3.375; 18 44.005,3.375; 19 46.545,3.375; 20 49.086,3.375; 21 51.626,3.375; 22 54.166,3.375; 23 56.706,3.375; 24 59.245,3.375; 25 61.785,3.375; 26 64.326,3.375; 27 66.865,3.375; 28 69.406,3.375 | smd 1.651 x 6.35: 29 69.406,3.375; 30 66.865,3.375; 31 64.326,3.375; 32 61.785,3.375; 33 59.245,3.375; 34 56.706,3.375; 35 54.166,3.375; 36 51.626,3.375; 37 49.086,3.375; 38 46.545,3.375; 39 44.005,3.375; 40 41.465,3.375; 41 38.925,3.375; 42 36.386,3.375; 43 33.846,3.375; 44 31.305,3.375; 45 28.765,3.375; 46 26.226,3.375; 47 23.686,3.375; 48 21.145,3.375; 49 18.605,3.375; 50 16.066,3.375; 51 13.525,3.375; 52 10.986,3.375; 53 8.445,3.375; 54 5.905,3.375; 55 3.365,3.375; 56 0.826,3.375
HC49US = drill 0.7 pad 1.651: 1 -2.54,0; 2 2.54,0
CRYSTAL-SMD-3.2X1.5MM = smd 1 x 1.8: P$1 -1.25,0; P$2 1.25,0

### Placement (x,y rotation side)
C1  32.9,45.7 90 top
C2  32.9,49.4 90 top
C3  54.5,38.6 90 top
C4  62.3,50.3 180 top
C5  43.7,71 270 top
C6  46,71 270 top
C7  55.9,76.1 270 top
C8  55.9,72.1 90 top
C9  50.7,81.4 180 top
C10  30.9,82.6 0 bottom
C11  33.6,77.9 180 top
C12  30.9,80.6 0 bottom
C13  40,51.1 90 bottom
C14  40.5,54.5 0 bottom
C15  42.7,42.6 180 bottom
C16  61.4,53.2 90 top
C17  58.7,37.4 0 top
C18  45.2,59.3 90 top
C19  49.3,38 270 top
C20  41.5,38.5 180 top
C21  16.4,42 90 top
C22  18.6,42 90 top
D1  75.2,99.5 0 top
D2  71,99.5 0 top
D3  66.7,99.5 0 top
D4  62.3,99.5 0 top
D5  3.6,13.3 0 top
D6  39.3,99.5 0 top
D7  43,99.5 0 top
D8  46.7,99.5 0 top
D9  50.5,99.5 0 top
D10  54.2,99.5 0 top
D11  57.9,99.5 0 top
J1  88.5,95.3 270 top
P1  8.1,82.3 270 top
Q1  57,17.4 180 bottom
Q2  61.3,17.4 180 bottom
Q3  65.7,17.4 180 bottom
Q4  70,17.4 180 bottom
Q5  74.3,17.4 180 bottom
Q6  78.6,17.4 180 bottom
Q7  82.9,17.4 180 bottom
Q8  87.2,17.4 180 bottom
R1  39.4,96.5 180 top
R2  43,96.5 0 top
R3  46.8,96.5 0 top
R4  50.7,96.5 0 top
R5  54.4,96.5 0 top
R6  58,96.5 0 top
R11  87.3,84.4 270 top
R12  91.8,78.9 270 top
R13  94.1,79.8 270 top
R14  75.3,96.5 180 top
R15  71.1,96.5 180 top
R16  66.9,96.5 180 top
R17  62.5,96.5 180 top
R20  87.4,78 270 top
R21  31.5,73.3 90 top
R22  35,71.5 270 top
R23  25.4,91.8 180 top
R24  60.3,74.5 270 top
R25  26.5,86.9 0 top
R26  26.5,89 0 top
R27  14.2,42 270 top
R28  30.1,77.7 270 bottom
R29  34.2,80.2 180 bottom
R30  49.3,61.1 90 top
R31  36.3,37.6 90 bottom
R32  3.6,15.9 0 top
S1  10.4,47.8 0 top
SWDIO/SWDCLK/RESET  78.1,88.8 270 top
U1  43.1,78.2 0 top
U2  51.8,47 0 top
U$1  15.8,0 0 top
Y1  36.9,46.9 90 top
Y2  52.2,74.4 270 top
Y3  42.4,50.9 90 bottom

### Tracks (layer width: path | path; a pad name or v marks a point on that pad's centre or on a via)
3V3_CNTRL  (via drill 0.35)
  Top 0.152: v49.6,8.1 49.6,16.7 40.2,26.1 40.2,39.74 | 40.2,39.74 40.2,45.1 42.35,47.25 U2.8 | 40.2,39.74 C20.2
  Bottom 0.152: U$1.14 49.65,8.05 v49.6,8.1 | R31.2 38.91,38.45 C20.2
5V_CNTRL  (via drill 0.35)
  Top 0.152: v46.6,10.1 46.6,16 42.8,19.8 v33.1,19.8 | v24.4,41.5 24.4,22.5 27,19.9 v30.5,19.9 | v24.6,44.1 24.6,53.8 v24.7,53.9 | U2.2 45.41,50.25 41.16,54.5 v28.5,54.5
  Bottom 0.152: U$1.15 52.19,7.11 49.5,9.8 46.9,9.8 v46.6,10.1 | v30.5,19.9 33,19.9 v33.1,19.8 | v24.6,44.1 24.6,41.7 v24.4,41.5 | v28.5,54.5 25.3,54.5 v24.7,53.9
12V_CNTRL  (via drill 0.35)
  Top 0.152: v51.3,9.3 51.3,30.1 v52,30.8 | v52.3,35.5 52.3,40.4 52.42,40.52 52.42,41.2 U2.26
  Bottom 0.152: U$1.16 54.73,5.88 v51.3,9.3 | v52,30.8 52,35.2 v52.3,35.5
+3V3  (via drill 0.35)  (1 unrouted)
  Top 0.152: U2.48 58.22,51.5 v59.8,51.5 60.55,51.5 C16.1 | 3.95,41.15 3.9,41.1 | v60.3,39.9 58.93,38.53 58.05,38.53 | 58.05,38.53 58.02,38.5 v56.2,38.5 | 57.85,22.05 58.1,21.8 | 58.05,38.53 58.05,37.6 C17.1 | U2.32 55.55,41.03 58.05,38.53 | 20.5,57.3 20.6,57.4 | v50.8,39.6 49.9,39.6 49.05,40.45 U2.19 49.05,39.1 C19.1 | 4.1,37.9 3.95,37.9 3.9,37.9 | 45.55,56.15 45.2,56.5 | v41.8,44.5 42.12,44.82 46.06,44.82 U2.13 | 87.4,74.3 87.4,76.2 85.6,78 85.6,83.84 SWDIO/SWDCLK/RESET.2 SWDIO/SWDCLK/RESET.1 | C9.2 49.75,81.3 48.4,81.3
  Top 0.406: U2.64 47.73,52.67
  Top 0.508: 42.65,59.05 45.55,56.15 45.55,54.85 47.73,52.67
  Top 0.61: v44.5,13.9 25.3,13.9 v19,7.6 3.9,22.7 | 58.1,21.8 v56.3,20 | 3.9,41.1 3.9,55.1 6.1,57.3 | 3.95,41.15 3.95,37.9 | 3.9,37.9 3.9,22.7 | 42.65,59.05 40.1,61.6 39.2,61.6 | 39.2,61.6 24.8,61.6 20.6,57.4 | R32.1 2.75,21.55 3.9,22.7 | C17.1 57.85,22.05 | 6.1,57.3 20.5,57.3 | v90.7,20.5 90.7,61.2 87.4,64.5 87.4,74.3 R20.2 | 4.1,37.9 5.9,39.7 12.75,39.7 R27.2 C21.1 C22.1 | 39.2,61.6 32.9,67.9 v32.9,69.3 | 45.2,56.5 C18.1 | 6.1,57.3 9.7,60.9 v9.7,65.1
  Bottom 0.152: 60.65,18.15 Q2.1 | 56.3,18.38 Q1.1 | v59.8,51.5 60.3,51 v60.3,39.9 | v50.8,39.6 55.1,39.6 v56.2,38.5 | v41.8,44.5 41.8,42.65 C15.1 41.85,40.69 C20.1
  Bottom 0.61: Q1.1 56.35,17.25 53,13.9 v44.5,13.9 | v56.3,20 56.3,18.38 | Q8.1 86.55,18.23 87.28,17.5 89.1,17.5 90.7,19.1 v90.7,20.5 | v9.7,65.1 v9.7,67 | P1.R3 13.1,85.56 13.1,90.1 v16.3,93.3
  pour Bottom (no thermals): 15.88,7.62 16.51,8.26 21.59,8.26 22.23,7.62 22.23,1.91 15.88,1.91
  pour Top (no thermals): 15.88,7.62 16.51,8.26 21.59,8.26 22.23,7.62 22.23,1.91 15.88,1.91
  pour Bottom: 55.6,19.1 55.6,16.4 56.7,15.3 89,15.3 89.1,15.2 89.1,18 87.7,19.4 55.9,19.4
  pour Top: 8.9,100.3 2.1,93.5 2.1,73.6 9.7,66 33.6,66 40.4,72.8 44.5,72.8 48.9,77.2 48.9,82.1 30.6,100.4 9,100.4
+5V
  pour Top (no thermals): 41.15,1.78 41.15,7.62 41.78,8.26 47.12,8.26 47.75,7.62 47.75,1.78
  pour Bottom (no thermals): 41.15,1.78 41.15,7.62 41.78,8.26 47.12,8.26 47.75,7.62 47.75,1.78
BP_SCL  (via drill 0.35)
  Top 0.152: U2.58 51.05,59.75 53.5,62.2 76.1,62.2 80.1,58.2 v80.1,40.1 | U$1.31 80.13,36.97 v80.1,37
  Bottom 0.152: v80.1,37 v80.1,40.1
BP_SDA  (via drill 0.35)
  Top 0.152: U2.59 50.68,52.8 50.68,59.81 53.37,62.51 76.3,62.51 80.9,57.91 v80.9,41.6 | U$1.32 77.58,38.49 v78,38.9
  Bottom 0.152: v78,38.9 80.7,41.6 v80.9,41.6
GND  (via drill 0.35)  (5 unrouted)
  Top 0.152: 67.58,99.52 D3.C 68.78,98.3 v68.8,98.3 | U1.48 39.92,82.38 v39.4,82.9 | C2.2 32.8,50.25 | S1.1 7.15,51.65 v7.2,51.7 | U2.12 46,45.38 45.32,45.38 44.8,45.9 43,45.9 v42.6,45.5 | 41.88,74.02 U1.16 | U2.63 48.55,55.65 v47.3,56.9 | v64.3,51.2 63.4,50.3 C4.1 | 33.15,49.9 32.8,50.25 | C16.2 62.1,54.75 v62.1,55.3 | D5.C v6.6,13.3 | C17.2 59.55,35.35 v59.6,35.3 | U2.18 48.55,37.9 C19.2 v49.3,35.4 | C3.1 54.5,37 v55.5,36 | 32.8,50.25 32.8,51 v32,51.8 | C1.2 32.45,47 v30.8,47 | U1.29 48.75,77.45 v49.9,76.3 | R30.2 49.25,62 | R30.2 48.85,61.95 v48.85,63.3 | C5.2 C6.2 v46,68.9 | 48.9,61.95 R30.2 | C8.2 v55.9,74.1 C7.2 | 43.88,99.92 D7.C 43.88,99.02 v44.9,98 | 51.38,99.92 D9.C 51.38,99.32 v52.4,98.3 | 71.8,99.5 D2.C 73,98.38 v73,98.1 | D6.C 40.18,99.02 v41,98.2 | D8.C 47.58,99.22 v48.6,98.2 | D10.C 55.08,99.12 v56.1,98.1 | D11.C 59.98,98.3 v60.1,98.3 | D4.C 63.18,99.22 v64.3,98.1 | v52.7,81.4 C9.1 | R21.1 30.05,71 v29.9,71 | J1.S3 v82.4,98.3 | J1.S4 v82.4,92.8 | J1.S2 v94.7,92.8 | J1.S1 v94.6,98.3 | J1.GND 86.9,91.4 v86.4,90.9 | D1.C v77.28,98.3 | C18.2 v45.2,61.4
  Bottom 0.152: 26.67,9.47 26.7,9.5 | 36.96,9.46 37,9.5
  Bottom 1.016: v26.67,7.62 26.67,9.47 | v36.96,7.62 36.96,9.46
  pour Top (no thermals): 23.5,7.62 24.13,8.26 29.21,8.26 29.84,7.62 29.84,1.91 23.5,1.91
  pour Bottom (no thermals): 23.5,7.62 24.13,8.26 29.21,8.26 29.84,7.62 29.84,1.91 23.5,1.91
  pour Top (no thermals): 33.66,1.78 40.13,1.78 40.13,7.62 39.62,8.26 34.04,8.26 33.53,7.62 33.53,1.91
  pour Bottom (no thermals): 33.53,7.62 33.53,1.91 33.66,1.78 40.01,1.78 40.01,4.06 40.01,5.71 40.13,5.84 40.13,7.62 39.62,8.26 34.04,8.26
  pour Bottom: -11.8,106.8 -11.8,18.3 -2.2,8.7 47.7,8.7 55.1,16.1 55.1,19.4 56.4,20.7 88.2,20.7 89.9,22.4 89.9,32.2 92.7,35 113.1,35 112.9,109 -9.6,109
JETS_CNTRL  (via drill 0.35)
  Top 0.152: v48.6,11.7 48.4,11.9 v48.4,16.2 | v48.4,19.8 47.3,20.9 47.3,45.5 47.05,45.75 U2.11
  Bottom 0.152: v48.4,16.2 v48.4,19.8 | U$1.18 59.81,5.89 56.6,9.1 53.9,9.1 51.5,11.5 48.8,11.5 v48.6,11.7
LED_BLUE  (via drill 0.35)
  Top 0.152: v52.8,60.3 52.8,54.1 52.18,53.48 52.18,52.8 U2.56 | v52.8,63.3 52.8,63.4 54.7,65.3 63.66,65.3 68.9,70.3 70.7,72.1 70.7,87.6 63.35,94.95 R17.1
  Bottom 0.152: v52.8,63.3 v52.8,60.3
LED_BLUE2  (via drill 0.35)
  Top 0.152: U2.51 54.61,52.73 54.61,53.55 54.76,53.69 v54.76,56.4 | v66.8,63.9 68.7,65.8 v68.7,66.6 | v68.7,71.3 68.7,79.5 55.3,92.9 55.3,96.45 R5.2
  Bottom 0.152: v54.76,56.4 55.6,57.24 55.6,58.3 56.5,59.2 64.8,59.2 66.8,61.2 v66.8,63.9 | v68.7,66.6 v68.7,71.3
LED_CYAN  (via drill 0.35)
  Top 0.152: R1.1 40.25,86.95 v41.8,85.4 | v41.8,80.4 39.93,78.53 39.93,75.22 38.8,74.09 v38.8,63.5 | v53,46.2 53.05,46.25 U2.39 | v38.8,60.7 38.8,59.84 48.5,50.14 v48.5,49.1
  Bottom 0.152: v41.8,85.4 v41.8,80.4 | v38.8,63.5 v38.8,60.7 | v53,46.2 50.7,46.2 48.5,48.4 v48.5,49.1
LED_CYAN2  (via drill 0.35)
  Top 0.152: R6.2 58.85,91.25 69.6,80.5 v69.6,72 | v69.6,67.7 70.9,66.4 v70.9,65.7 | v70.5,61.2 66.9,57.6 v66.9,50.4 | v65,47.2 64.95,47.25 U2.41
  Bottom 0.152: v69.6,72 v69.6,67.7 | v70.9,65.7 70.9,61.6 v70.5,61.2 | v66.9,50.4 66.9,49.1 v65,47.2
LED_GREEN  (via drill 0.35)
  Top 0.152: v54.5,63.7 55.49,64.69 64.03,64.69 71.35,72.02 71.35,88.9 67.75,92.5 R16.1 | U2.50 54.92,52.8 54.92,53.42 55.4,53.9 55.4,57.7 54.4,58.7 54.42,61.32 v54.5,61.4
  Bottom 0.152: v54.5,63.7 v54.5,61.4
LED_GREEN2  (via drill 0.35)
  Top 0.152: v54.16,57.8 v54.15,57.79 54.15,52.77 U2.52 | v51.9,62.5 48.2,66.2 v48.2,74 | v48.2,82 48.69,82.49 49.15,82.49 49.16,82.5 50.1,82.5 51.55,83.95 R4.2
  Bottom 0.152: v54.16,57.8 53.26,58.69 53.25,58.69 51.9,60.04 v51.9,62.5 | v48.2,74 v48.2,82
LED_RED  (via drill 0.35)
  Top 0.152: v64.4,63.6 72.96,72.16 72.96,87.46 76.15,90.65 R14.1 | v64.4,61.4 64.4,59.2 56,50.8 56,49.41 v54.7,48.11 | U2.55 52.55,50.75 v51.6,49.8
  Bottom 0.152: v64.4,63.6 v64.4,61.4 | v51.6,49.8 51.22,49.42 51.22,48.82 51.92,48.11 v54.7,48.11
LED_RED2  (via drill 0.35)
  Top 0.152: R2.2 43.85,85.05 v43.9,85 | v43.5,79 v42.3,77.8 | v40.1,71.7 v40.1,62.8 | v40.1,60.2 40.1,59.44 49.14,50.4 v49.2,50.4 | U2.40 55.55,46.75 54.8,47.5 v53.3,47.5
  Bottom 0.152: v43.9,85 43.9,79.4 v43.5,79 | v42.3,77.8 42.3,77.16 42.31,77.15 42.31,76.65 40.1,74.44 v40.1,71.7 | v40.1,62.8 v40.1,60.2 | v49.2,50.4 52.1,47.5 v53.3,47.5
LED_YELLOW  (via drill 0.35)
  Top 0.152: U2.57 51.55,54.25 v51.9,54.6 | v55.02,59.5 55.02,60.33 v56.2,61.5 | v56.2,63.6 56.89,64.29 64.25,64.29 71.95,71.99 R15.1
  Bottom 0.152: v51.9,54.6 55.02,57.73 v55.02,59.5 | v56.2,61.5 v56.2,63.6
LED_YELLOW2  (via drill 0.35)
  Top 0.152: U2.53 53.55,59.25 v53.5,59.3 | v48.9,75 48.9,74.36 48.89,74.35 48.89,70.31 53.5,65.7 v53.5,65.2 | v48.9,83.1 47.65,84.35 R3.2
  Bottom 0.152: v53.5,59.3 v53.5,65.2 | v48.9,75 48.9,75.94 48.89,75.95 48.89,76.65 48.9,76.66 v48.9,83.1
MOBO_CNTRL  (via drill 0.35)
  Top 0.152: v53.5,10.7 53.5,16.2 v53.2,16.5 | v50.2,19.5 47.6,22.09 47.6,45.63 47.18,46.05 47.15,46.05 46.95,46.25 U2.10
  Bottom 0.152: 62.35,3.15 U$1.19 62.35,5.65 57.9,10.1 54.1,10.1 v53.5,10.7 | v53.2,16.5 v50.2,19.5
N$1
  Top 0.152: U2.6 40.79,48.25 Y1.1 36.41,44.85 C1.1
N$2
  Top 0.152: R11.1 87.7,85.65 J1.ID
N$3
  Top 0.152: D1.A 74.32,96.63 R14.2
N$4
  Top 0.152: R12.1 91.8,86.2 88.5,89.5 J1.D+
N$5
  Top 0.152: J1.D- 89.3,90.95 94.1,86.15 R13.1
N$6
  Top 0.152: D2.A 70.12,96.63 R15.2
N$7
  Top 0.152: D3.A 65.82,96.73 R16.2
N$8
  Top 0.152: D4.A 61.42,96.73 R17.2
N$9
  Top 0.152: U2.5 37.59,48.75 36.97,49.37 | 36.97,49.37 Y1.2 | C2.1 36.15,48.55 36.97,49.37
N$10
  Top 0.152: U2.47 61.4,50.25 C4.2
N$11
  Top 0.152: U2.31 55.05,40 C3.2
N$12
  Top 0.152: U1.20 43.85,72 C5.1
N$13
  Top 0.152: U1.22 44.85,73 C6.1
N$14
  Top 0.152: U1.10 35.2,76.45 32.9,74.15 R21.2
N$15  (via drill 0.35)
  Top 0.152: U2.4 44.25,49.25 v44.1,49.4
  Bottom 0.152: v44.1,49.4 43.95,49.55 42.5,49.55 Y3.P$1 40.6,49.65 C13.1
N$16
  Top 0.152: P1.R2 18.41,86.9 R25.1 25.65,87.63 26.5,88.48 26.5,89.52 26.97,90 29.3,90 38.35,80.95 U1.1
N$17  (via drill 0.35)
  Top 0.152: P1.R1 16.7,89 R26.1 25.65,89.6 26.35,90.3 29.6,90.3 36.7,83.2 36.96,83.2 v37.48,82.68 | U1.2 37.95,80.45 37.42,80.98 v37.42,81.02
  Bottom 0.152: v37.42,81.02 37.42,82.62 v37.48,82.68
N$18  (via drill 0.35)
  Top 0.152: U1.5 37.35,78.95 v36.9,79.4
  Bottom 0.152: v36.9,79.4 36.1,80.2 R29.2 32.65,82.6 C10.1
N$19  (via drill 0.35)
  Top 0.152: U1.6 35,78.45 C11.1 32.75,76.2 v32.5,76.2
  Bottom 0.152: v32.5,76.2 30.75,76.2 R28.2
N$20
  Top 0.152: R22.2 32.55,70.65 27.7,65.8 9.58,65.8 3.2,72.17 P1.L2
N$21
  Top 0.152: P1.L4 6.38,91.8 R23.2
N$22  (via drill 0.35)
  Top 0.152: U1.27 44.51,76.45 44.05,76.91 41.41,76.91 v41.1,76.6 | R22.1 35,72.7 v36.2,73.9
  Bottom 0.152: v41.1,76.6 40.2,75.7 38,75.7 v36.2,73.9
N$23  (via drill 0.35)
  Top 0.152: R23.1 29.2,91.8 v36.9,84.1 | U1.25 45.95,75.45 45.5,75.9 43.7,75.9 v43.4,76.2
  Bottom 0.152: v43.4,76.2 43.4,77.7 37,84.1 v36.9,84.1
N$24
  Top 0.152: U1.30 49.35,77.95 52.2,75.1 Y2.2 52.81,71.25 C8.1 57.9,71.25 R24.2
N$25
  Top 0.152: U1.31 49.49,78.45 51,76.94 Y2.1 55.84,76.94 55.88,76.97 C7.1 58.7,76.95 R24.1
N$26
  Bottom 0.152: P1.R8 23.91,77.86 28.65,82.6 C10.2
N$27
  Top 0.152: C11.2 26.3,77.9 25.2,79 14.57,79 P1.R7
N$28
  Bottom 0.152: R29.1 32.95,80.6 C12.1 30.1,78.95 R28.1
N$29  (via drill 0.35)
  Top 0.152: U2.3 45.45,49.75 44.5,50.7 v44.1,50.7
  Bottom 0.152: v44.1,50.7 43.85,50.7 Y3.P$2 42.4,53.45 C14.1
N$30
  Top 0.152: R30.1 50.05,59.5 U2.60
N$31
  Top 0.152: R32.2 4.45,15.03 D5.A
N$32
  Top 0.152: R1.2 38.42,96.63 D6.A
N$33
  Top 0.152: R2.1 42.15,99.47 D7.A
N$35
  Top 0.152: R3.1 45.95,99.37 D8.A
N$36
  Top 0.152: R4.1 49.85,99.27 D9.A
N$37
  Top 0.152: R5.1 53.55,99.27 D10.A
N$38
  Top 0.152: R6.1 57.15,99.37 D11.A
PLTA_CNTRL  (via drill 0.35)
  Top 0.152: U2.9 46,46.62 42.46,46.62 40.9,45.06 v40.9,31.8 | v31.7,15.6 31.7,22.5 v39,29.8
  Bottom 0.152: v31.7,15.6 31.7,3.54 U$1.7 | v39,29.8 40.9,31.7 v40.9,31.8
PWM_3V3_CH1  (via drill 0.35)
  Top 0.152: U2.61 49.5,52.72 49.5,58 48.5,59 v47.4,59 | v26,41 26,23.3 28.1,21.2 v30.5,21.2 | v43.9,21 33.2,21 v33.1,21.1 | v26,44 26,54.8 30.2,59 37.38,59 v37.4,59.02
  Bottom 0.152: Q1.2 57.65,20.62 57.08,21.2 44.09,21.2 v43.9,21 | v26,41 v26,44 | v37.4,59.02 47.38,59.02 v47.4,59 | v30.5,21.2 30.6,21.1 v33.1,21.1
PWM_3V3_CH2  (via drill 0.35)
  Top 0.152: U2.62 49.1,52.72 49.1,57.4 v48.5,58 | v27.6,41.5 27.6,23.9 28.8,22.7 v30.5,22.7 | v42.9,22.1 33.7,22.1 v33.1,22.7 | v27.6,44.2 27.6,55.1 30.7,58.2 v38.6,58.2
  Bottom 0.152: Q2.2 58.17,22.1 v42.9,22.1 | v33.1,22.7 v30.5,22.7 | v27.6,41.5 v27.6,44.2 | v38.6,58.2 48.5,58.2 v48.5,58
PWM_3V3_CH3  (via drill 0.35)
  Top 0.152: v66.3,20.7 66.3,30.1 76,39.8 76,41.51 73.28,44.22 57.5,44.22 U2.35
  Bottom 0.152: Q3.2 66.35,20.65 v66.3,20.7
PWM_3V3_CH4  (via drill 0.35)
  Top 0.152: v70.6,20.4 70.6,33.9 76.3,39.6 76.3,41.8 73.3,44.8 73.25,44.75 U2.36
  Bottom 0.152: Q4.2 70.65,20.35 v70.6,20.4
PWM_3V3_CH5  (via drill 0.35)
  Top 0.152: v45.6,22.9 41.9,26.6 41.9,43.3 42.85,44.25 U2.14
  Bottom 0.152: Q5.2 70.38,22.9 v45.6,22.9
PWM_3V3_CH6  (via drill 0.35)
  Top 0.152: v46.6,23.6 45.81,24.39 45.55,24.39 42.3,27.64 42.3,42.7 43.35,43.75 U2.15
  Bottom 0.152: Q6.2 73.97,23.6 v46.6,23.6
PWM_3V3_CH7  (via drill 0.35)
  Top 0.152: v45.8,25 42.8,28 42.8,42.5 43.55,43.25 U2.16
  Bottom 0.152: Q7.2 76.88,25 50.46,25 50.45,24.99 49.95,24.99 49.94,25 v45.8,25
PWM_3V3_CH8  (via drill 0.35)
  Top 0.152: v50.2,25.6 48.05,27.75 U2.17
  Bottom 0.152: Q8.2 87.57,18.32 80.3,25.6 v50.2,25.6
PWM_CH1
  Bottom 0.152: U$1.20 64.89,8.59 Q1.3
PWM_CH2
  Bottom 0.152: Q2.3 67.42,10.35 U$1.21
PWM_CH3
  Bottom 0.152: Q3.3 69.97,12.21 U$1.22
PWM_CH4
  Bottom 0.152: Q4.3 72.5,13.97 U$1.23
PWM_CH5
  Bottom 0.152: Q5.3 75.05,15.73 U$1.24
PWM_CH6
  Bottom 0.152: U$1.25 77.58,15.46 Q6.3
PWM_CH7
  Bottom 0.152: U$1.26 80.13,8.63 82.9,11.4 Q7.3
PWM_CH8
  Bottom 0.152: U$1.27 82.8,3.51 82.8,8.2 87.2,12.6 Q8.3
RESET  (via drill 0.35)
  Top 0.152: S1.3 9.79,42.9 14.15,42.9 R27.1 | R27.1 14.25,42.9 | 45.7,47.75 42.05,47.75 37.15,42.85 C22.2 C21.2 R27.1 | 45.7,47.75 U2.7 | SWDIO/SWDCLK/RESET.15 76.5,69.42 76.5,66.37 73.03,62.9 53.3,62.9 51.5,61.1 47.7,61.1 46.5,59.9 46.5,55.2 v47.3,54.4 | v47.7,48.4 47.7,48.1 47.3,47.7 45.75,47.7 45.7,47.75
  Bottom 0.152: v47.3,54.4 47.7,54 v47.7,48.4
ROBOT_SCL  (via drill 0.35)
  Top 0.152: v73.9,42.4 67.2,42.4 66.1,41.3 57.5,41.3 55.9,42.9 54.4,42.9 54.05,42.55 U2.29 | U$1.29 85.21,33.99 v76.8,42.4
  Bottom 0.152: v76.8,42.4 v73.9,42.4
ROBOT_SDA  (via drill 0.35)
  Top 0.152: U2.30 54.6,41.38 54.6,42.4 54.8,42.59 55.77,42.59 57.37,40.99 66.23,40.99 66.23,41 v75,41 | U$1.30 82.67,35.33 v77,41
  Bottom 0.152: v77,41 75.1,41 v75,41
SPARE_1  (via drill 0.35)
  Top 0.152: v72.4,46.9 71.39,47.91 64.65,47.91 64.59,47.85 57.57,47.85 U2.42 | v75.1,46.7 77.6,46.7 v79.4,44.9 | v81.6,44.1 86.5,39.2 v86.5,9.2
  Bottom 0.152: v72.4,46.9 72.6,46.7 v75.1,46.7 | v79.4,44.9 80.2,44.1 v81.6,44.1 | v86.5,9.2 86.5,4.67 U$1.28
SPARE_2  (via drill 0.35)
  Top 0.152: U2.43 72.45,48.25 v78.3,42.4 | v76.5,38.9 76.5,10.3 75,8.8 75,3.42 U$1.33
  Bottom 0.152: v78.3,42.4 78.3,40.7 v76.5,38.9
SPI_MISO  (via drill 0.35)
  Top 0.152: U2.22 50.68,41.46 50.68,47.81 53.4,50.53 v53.4,51.3 | v61.69,61.5 61.69,59.39 v58,55.7 | v61.69,66 61.69,76.51 58.3,79.9 47.33,79.9 U1.34
  Bottom 0.152: v61.69,66 v61.69,61.5 | v58,55.7 53.6,51.3 v53.4,51.3
SPI_MOSI  (via drill 0.35)
  Top 0.152: v54.7,51.3 51.05,47.65 U2.23 | v62.7,61.5 62.7,59.3 v58,54.6 | v62.7,66 62.7,76 58.2,80.5 47.33,80.5 U1.35
  Bottom 0.152: v62.7,66 v62.7,61.5 | v58,54.6 v54.7,51.3
SPI_RESET  (via drill 0.35)
  Top 0.152: v44.7,80.8 45.07,80.8 45.85,81.58 U1.37 | v57.3,61.5 57.3,52.7 52.02,47.42 52.02,41.36 U2.25 | v57.3,66.3 55.5,68.1 52,68.1 v49.5,70.6
  Bottom 0.152: v44.7,80.8 44.7,75.4 v49.5,70.6 | v57.3,66.3 v57.3,61.5
SPI_SCK  (via drill 0.35)
  Top 0.152: v51.9,51.3 50.05,49.45 U2.21 | U1.33 47.37,79.53 57.06,79.53 v58.4,78.2 | v60.7,61.5 60.7,59.4 v58,56.7 | v60.7,66 60.7,71.3 v59.8,72.2
  Bottom 0.152: v60.7,66 v60.7,61.5 | v51.9,51.3 53.5,52.9 53.8,52.9 57.6,56.7 v58,56.7 | v59.8,72.2 59.8,76.8 v58.4,78.2
SPI_SS  (via drill 0.35)
  Top 0.152: v50.9,51.2 49.55,49.85 U2.20 | v59.7,61.5 59.7,59.6 v58,57.9 | v59.7,66 56.7,69 52.3,69 50.9,70.4 v50.9,74.5 | v50.1,78.86 47.37,78.86 U1.32
  Bottom 0.152: v59.7,66 v59.7,61.5 | v58,57.9 57.6,57.9 v50.9,51.2 | v50.9,74.5 50.9,77.96 50.9,78.06 v50.1,78.86
SW_1  (via drill 0.35)
  Top 0.152: U$1.38 62.35,39.15 v62.3,39.2 | v62.3,43.1 61.65,43.75 U2.34
  Bottom 0.152: v62.3,39.2 v62.3,43.1
SW_2  (via drill 0.35)
  Top 0.152: U$1.39 59.81,9.71 61.5,11.4 61.5,38.2 v61.3,38.4 | v61.3,45.4 61.2,45.5 59.1,45.5 58.8,45.2 57.52,45.2 U2.37
  Bottom 0.152: v61.3,38.4 v61.3,45.4
SW_3  (via drill 0.35)
  Top 0.152: U$1.40 57.27,8.57 60.8,12.1 v60.8,37.2 | U2.38 58.92,45.75 59.18,46.01 65.99,46.01 v66.3,45.7
  Bottom 0.152: v60.8,37.2 61.3,37.7 65,37.7 66.3,39 v66.3,45.7
SW_4
  Top 0.152: U$1.41 54.73,30.57 51.5,33.8 51.5,41.28 U2.24
SW_5  (via drill 0.35)
  Top 0.152: U$1.42 52.19,17.69 54,19.5 v54,29.9 | v54,34.4 54,35.9 53.05,36.85 U2.27
  Bottom 0.152: v54,29.9 v54,34.4
SW_KILL  (via drill 0.35)
  Top 0.152: U$1.37 64.89,9.06 64.69,9.25 v64.69,39.09 v64.7,39.1 | v64.6,42.2 64.55,42.15 58.57,42.15 U2.33
  Bottom 0.152: v64.6,42.2 64.6,39.2 v64.7,39.1
SWCLK  (via drill 0.35)
  Top 0.152: v56.6,58 56.25,57.65 56.25,53.37 U2.49 | v64.2,57.3 67.8,60.9 v67.8,61.5 | v69.9,63.6 73.3,63.6 76.1,66.4 76.1,76.64 SWDIO/SWDCLK/RESET.9
  Bottom 0.152: v67.8,61.5 v69.9,63.6 | v64.2,57.3 60.6,57.3 59.1,58.8 57.4,58.8 v56.6,58
SWDIO  (via drill 0.35)
  Top 0.152: U2.46 60.63,49.75 60.97,49.41 68.5,49.41 75.1,56.01 v75.1,60.4 | SWDIO/SWDCLK/RESET.7 75.1,78.18 v75.1,67
  Bottom 0.152: v75.1,60.4 v75.1,67
USB_DN  (via drill 0.35)
  Top 0.152: U2.44 57.52,48.7 69.3,48.7 78.6,58 78.7,58 v78.9,58.2 | v89.1,70.8 94.1,75.8 R13.2 | v86.1,70.9 86.1,65.3 81.1,60.3 v80.8,60
  Bottom 0.152: v89.1,70.8 89,70.9 v86.1,70.9 | v80.8,60 80.7,60 v78.9,58.2
USB_DP  (via drill 0.35)
  Top 0.152: v77.6,59.3 77.6,57.7 69,49.1 58.3,49.1 58.28,49.12 57.6,49.12 U2.45 | v88.7,72.6 91.8,75.7 R12.2 | v79.2,61 84.7,66.5 84.7,71.1 v86.1,72.5
  Bottom 0.152: v86.1,72.5 88.6,72.5 v88.7,72.6 | v77.6,59.3 77.6,59.4 v79.2,61
USB_ID
  Top 0.152: R11.2 87.3,78.95 R20.1

### Text on the board
tPlace: 3V3 | Coprocessor | The Underwater Robotics Team / Center for Automotive Research
tNames: RESET